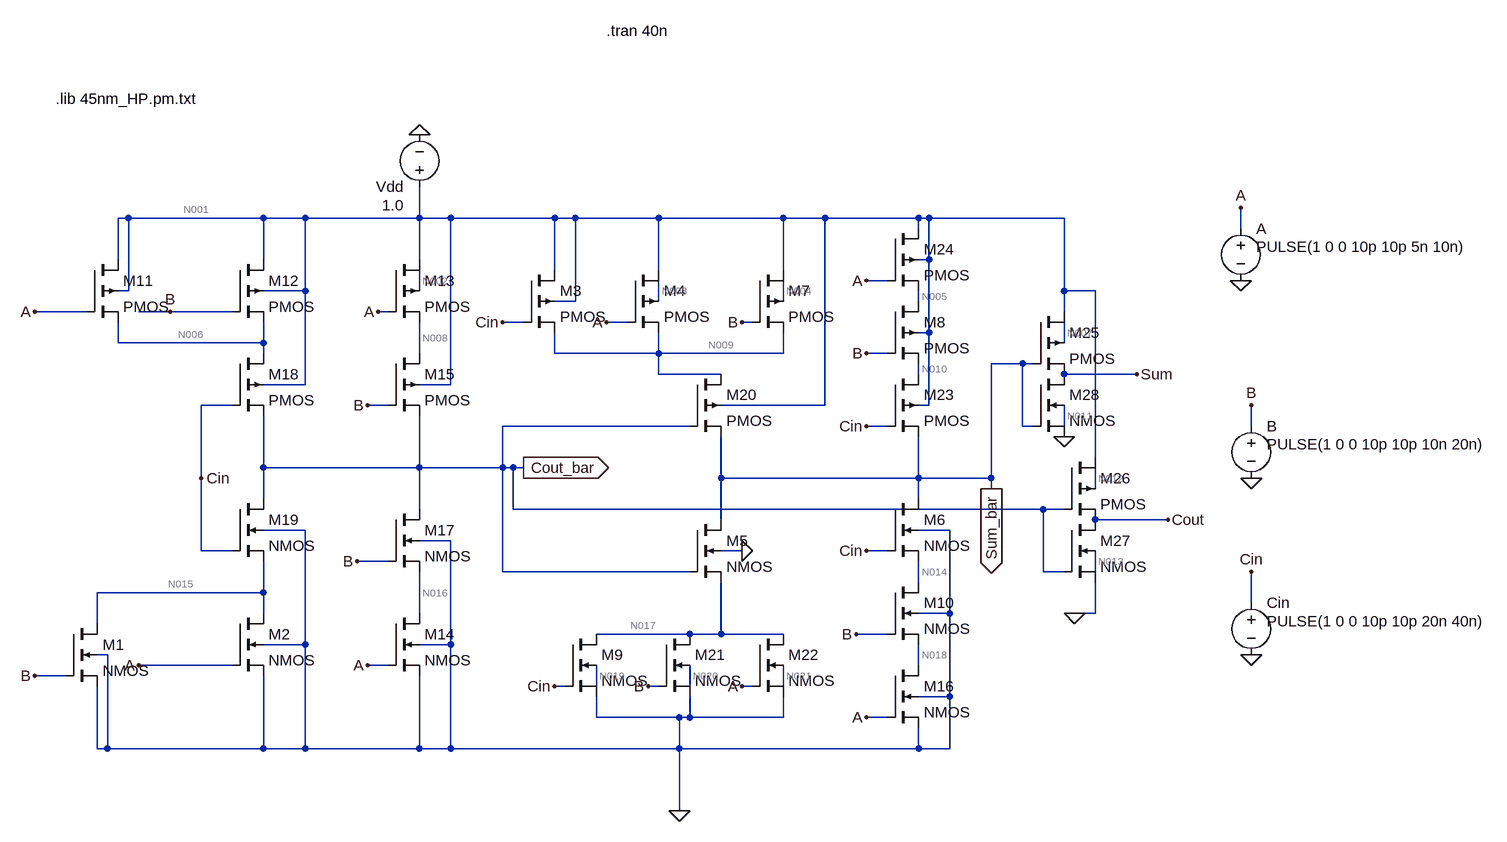
[diagram p0: schematic 28T_45nm.asc]
28T_45nm.asc, the LTspice schematic file:
Version 4
SHEET 1 1060 692
WIRE -1088 -240 -1104 -240
WIRE -880 -240 -1088 -240
WIRE -816 -240 -880 -240
WIRE -640 -240 -640 -288
WIRE -640 -240 -816 -240
WIRE -592 -240 -640 -240
WIRE -432 -240 -592 -240
WIRE -400 -240 -432 -240
WIRE -272 -240 -400 -240
WIRE -80 -240 -272 -240
WIRE -16 -240 -80 -240
WIRE 128 -240 -16 -240
WIRE 144 -240 128 -240
WIRE 352 -240 144 -240
WIRE 128 -224 128 -240
WIRE 624 -224 624 -256
WIRE -1104 -176 -1104 -240
WIRE -880 -176 -880 -240
WIRE -640 -176 -640 -240
WIRE 144 -176 144 -240
WIRE 144 -176 128 -176
WIRE -432 -160 -432 -240
WIRE -272 -160 -272 -240
WIRE -80 -160 -80 -240
WIRE 80 -144 48 -144
WIRE -1088 -128 -1088 -240
WIRE -1088 -128 -1104 -128
WIRE -816 -128 -816 -240
WIRE -816 -128 -880 -128
WIRE -640 -128 -640 -160
WIRE 352 -128 352 -240
WIRE 400 -128 352 -128
WIRE -400 -112 -400 -240
WIRE -400 -112 -432 -112
WIRE -272 -112 -272 -144
WIRE -80 -112 -80 -144
WIRE 128 -112 128 -128
WIRE -1152 -96 -1232 -96
WIRE -1024 -96 -1072 -96
WIRE -928 -96 -1024 -96
WIRE -688 -96 -704 -96
WIRE 352 -96 352 -128
WIRE -480 -80 -512 -80
WIRE -320 -80 -352 -80
WIRE -128 -80 -144 -80
WIRE 144 -64 144 -176
WIRE 144 -64 128 -64
WIRE -1104 -48 -1104 -80
WIRE -880 -48 -880 -80
WIRE -880 -48 -1104 -48
WIRE 352 -48 352 -80
WIRE -880 -32 -880 -48
WIRE -640 -32 -640 -80
WIRE -432 -32 -432 -64
WIRE -272 -32 -272 -64
WIRE -272 -32 -432 -32
WIRE -80 -32 -80 -64
WIRE -80 -32 -272 -32
WIRE 80 -32 48 -32
WIRE 288 -16 240 -16
WIRE 304 -16 288 -16
WIRE -272 0 -272 -32
WIRE -176 0 -272 0
WIRE 128 0 128 -16
WIRE 464 0 352 0
WIRE -816 16 -816 -128
WIRE -816 16 -880 16
WIRE -592 16 -592 -240
WIRE -592 16 -640 16
WIRE -928 48 -976 48
WIRE -688 48 -720 48
WIRE -16 48 -16 -240
WIRE -16 48 -176 48
WIRE 144 48 144 -64
WIRE 144 48 128 48
WIRE -224 80 -512 80
WIRE 80 80 48 80
WIRE 288 80 288 -16
WIRE 304 80 288 80
WIRE 352 80 352 48
WIRE 640 80 640 48
WIRE 400 128 400 -128
WIRE -880 144 -880 64
WIRE -640 144 -640 64
WIRE -640 144 -880 144
WIRE -512 144 -512 80
WIRE -512 144 -640 144
WIRE -496 144 -512 144
WIRE -480 144 -496 144
WIRE -976 160 -976 48
WIRE -176 160 -176 96
WIRE 128 160 128 96
WIRE 128 160 -176 160
WIRE 240 160 240 -16
WIRE 240 160 128 160
WIRE 240 176 240 160
WIRE 400 176 400 144
WIRE -880 192 -880 144
WIRE 128 192 128 160
WIRE -640 208 -640 144
WIRE -496 208 -496 144
WIRE 320 208 -496 208
WIRE 352 208 320 208
WIRE -176 224 -176 160
WIRE 512 224 400 224
WIRE -816 240 -880 240
WIRE 176 240 128 240
WIRE -592 256 -640 256
WIRE -976 272 -976 160
WIRE -928 272 -976 272
WIRE -144 272 -176 272
WIRE 80 272 48 272
WIRE -688 288 -736 288
WIRE -512 304 -512 144
WIRE -224 304 -512 304
WIRE 320 304 320 208
WIRE 352 304 320 304
WIRE 400 304 400 272
WIRE 128 320 128 288
WIRE -880 336 -880 288
WIRE -880 336 -1136 336
WIRE 640 352 640 304
WIRE -880 368 -880 336
WIRE -640 368 -640 304
WIRE 176 368 176 240
WIRE 176 368 128 368
WIRE 368 368 352 368
WIRE 400 368 400 320
WIRE 400 368 368 368
WIRE -1136 384 -1136 336
WIRE -224 400 -368 400
WIRE -176 400 -176 320
WIRE -176 400 -224 400
WIRE -80 400 -176 400
WIRE 80 400 32 400
WIRE -816 416 -816 240
WIRE -816 416 -880 416
WIRE -592 416 -592 256
WIRE -592 416 -640 416
WIRE -1120 432 -1136 432
WIRE -928 448 -1072 448
WIRE -688 448 -720 448
WIRE 128 448 128 416
WIRE -1184 464 -1232 464
WIRE -416 480 -432 480
WIRE -368 480 -368 448
WIRE -272 480 -288 480
WIRE -224 480 -224 448
WIRE -128 480 -144 480
WIRE -80 480 -80 448
WIRE 176 496 176 368
WIRE 176 496 128 496
WIRE -368 528 -368 496
WIRE -240 528 -368 528
WIRE -224 528 -224 496
WIRE -224 528 -240 528
WIRE -80 528 -80 496
WIRE -80 528 -224 528
WIRE 80 528 48 528
WIRE -1136 576 -1136 480
WIRE -1120 576 -1120 432
WIRE -1120 576 -1136 576
WIRE -880 576 -880 464
WIRE -880 576 -1120 576
WIRE -816 576 -816 416
WIRE -816 576 -880 576
WIRE -640 576 -640 464
WIRE -640 576 -816 576
WIRE -592 576 -592 416
WIRE -592 576 -640 576
WIRE -240 576 -240 528
WIRE -240 576 -592 576
WIRE 128 576 128 544
WIRE 128 576 -240 576
WIRE 176 576 176 496
WIRE 176 576 128 576
WIRE -240 672 -240 576
FLAG -240 672 0
FLAG -480 144 Cout_bar
IOPIN -480 144 Out
FLAG 240 176 Sum_bar
IOPIN 240 176 Out
FLAG 624 -144 0
FLAG 640 160 0
FLAG 640 432 0
FLAG 624 -256 A
FLAG 640 48 B
FLAG 640 304 Cin
FLAG -640 -368 0
FLAG -1024 -96 B
FLAG -144 -80 B
FLAG -1072 448 A
FLAG -352 -80 A
FLAG -976 160 Cin
FLAG 48 80 Cin
FLAG 48 272 Cin
FLAG -512 -80 Cin
FLAG -432 480 Cin
FLAG -288 480 B
FLAG -144 480 A
FLAG 48 -144 A
FLAG 48 -32 B
FLAG -1232 -96 A
FLAG -1232 464 B
FLAG -144 272 0
FLAG 32 400 B
FLAG 48 528 A
FLAG -720 48 B
FLAG -736 288 B
FLAG -704 -96 A
FLAG -720 448 A
FLAG 368 368 0
FLAG 352 96 0
FLAG 464 0 Sum
FLAG 512 224 Cout
SYMBOL voltage 624 -240 R0
WINDOW 3 24 44 Left 2
WINDOW 123 0 0 Left 0
WINDOW 39 0 0 Left 0
SYMATTR Value PULSE(1 0 0 10p 10p 5n 10n)
SYMATTR InstName A
SYMBOL voltage 640 64 R0
WINDOW 3 24 44 Left 2
WINDOW 123 0 0 Left 0
WINDOW 39 0 0 Left 0
SYMATTR Value PULSE(1 0 0 10p 10p 10n 20n)
SYMATTR InstName B
SYMBOL voltage 640 336 R0
WINDOW 3 24 44 Left 2
WINDOW 123 0 0 Left 0
WINDOW 39 0 0 Left 0
SYMATTR Value PULSE(1 0 0 10p 10p 20n 40n)
SYMATTR InstName Cin
SYMBOL voltage -640 -272 R180
WINDOW 3 24 -12 Left 2
WINDOW 123 0 0 Left 0
WINDOW 39 0 0 Left 0
SYMATTR Value 1.0
SYMATTR InstName Vdd
SYMBOL nmos4 80 192 R0
SYMATTR InstName M6
SYMATTR Value2 l=45n w=90n
SYMBOL pmos4 80 -224 R0
SYMATTR InstName M24
SYMATTR Value2 l=45n w=180n
SYMBOL pmos4 80 -112 R0
SYMATTR InstName M8
SYMATTR Value2 l=45n w=180n
SYMBOL pmos4 80 0 R0
SYMATTR InstName M23
SYMATTR Value2 l=45n w=180n
SYMBOL nmos4 80 320 R0
SYMATTR InstName M10
SYMATTR Value2 l=45n w=90n
SYMBOL nmos4 80 448 R0
SYMATTR InstName M16
SYMATTR Value2 l=45n w=90n
SYMBOL nmos4 -416 400 R0
SYMATTR InstName M9
SYMATTR Value2 l=45n w=90n
SYMBOL nmos4 -272 400 R0
SYMATTR InstName M21
SYMATTR Value2 l=45n w=90n
SYMBOL nmos4 -128 400 R0
SYMATTR InstName M22
SYMATTR Value2 l=45n w=90n
SYMBOL nmos4 -224 224 R0
SYMATTR InstName M5
SYMATTR Value2 l=45n w=90n
SYMBOL pmos4 -480 -160 R0
SYMATTR InstName M3
SYMATTR Value2 l=45n w=180n
SYMBOL pmos4 -320 -160 R0
SYMATTR InstName M4
SYMATTR Value2 l=45n w=180n
SYMBOL pmos4 -128 -160 R0
SYMATTR InstName M7
SYMATTR Value2 l=45n w=180n
SYMBOL pmos4 -224 0 R0
SYMATTR InstName M20
SYMATTR Value2 l=45n w=180n
SYMBOL pmos4 -1152 -176 R0
SYMATTR InstName M11
SYMATTR Value2 l=45n w=180n
SYMBOL pmos4 -928 -176 R0
SYMATTR InstName M12
SYMATTR Value2 l=45n w=180n
SYMBOL pmos4 -688 -176 R0
SYMATTR InstName M13
SYMATTR Value2 l=45n w=180n
SYMBOL pmos4 -688 -32 R0
SYMATTR InstName M15
SYMATTR Value2 l=45n w=180n
SYMBOL pmos4 -928 -32 R0
SYMATTR InstName M18
SYMATTR Value2 l=45n w=180n
SYMBOL nmos4 -1184 384 R0
SYMATTR InstName M1
SYMATTR Value2 l=45n w=90n
SYMBOL nmos4 -928 368 R0
SYMATTR InstName M2
SYMATTR Value2 l=45n w=90n
SYMBOL nmos4 -688 368 R0
SYMATTR InstName M14
SYMATTR Value2 l=45n w=90n
SYMBOL nmos4 -688 208 R0
SYMATTR InstName M17
SYMATTR Value2 l=45n w=90n
SYMBOL nmos4 -928 192 R0
SYMATTR InstName M19
SYMATTR Value2 l=45n w=90n
SYMBOL pmos4 304 -96 R0
SYMATTR InstName M25
SYMATTR Value2 l=45n w=180n
SYMBOL pmos4 352 128 R0
SYMATTR InstName M26
SYMATTR Value2 l=45n w=180n
SYMBOL nmos4 352 224 R0
SYMATTR InstName M27
SYMATTR Value2 l=45n w=90n
SYMBOL nmos4 304 0 R0
SYMATTR InstName M28
SYMATTR Value2 l=45n w=90n
TEXT -1200 -424 Left 2 !.lib 45nm_HP.pm.txt
TEXT -352 -528 Left 2 !.tran 40n

The netlist it stands for:
* 28T_45nm.asc
V§A A 0 PULSE(1 0 0 10p 10p 5n 10n)
V§B B 0 PULSE(1 0 0 10p 10p 10n 20n)
V§Cin Cin 0 PULSE(1 0 0 10p 10p 20n 40n)
Vdd N001 0 1.0
M6 Sum_bar Cin N014 0 NMOS l=45n w=90n
M24 N001 A N005 N001 PMOS l=45n w=180n
M8 N005 B N010 N001 PMOS l=45n w=180n
M23 N010 Cin Sum_bar N001 PMOS l=45n w=180n
M10 N014 B N018 0 NMOS l=45n w=90n
M16 N018 A 0 0 NMOS l=45n w=90n
M9 N017 Cin 0 N019 NMOS l=45n w=90n
M21 N017 B 0 N020 NMOS l=45n w=90n
M22 N017 A 0 N021 NMOS l=45n w=90n
M5 Sum_bar Cout_bar N017 0 NMOS l=45n w=90n
M3 N001 Cin N009 N001 PMOS l=45n w=180n
M4 N001 A N009 N003 PMOS l=45n w=180n
M7 N001 B N009 N004 PMOS l=45n w=180n
M20 N009 Cout_bar Sum_bar N001 PMOS l=45n w=180n
M11 N001 A N006 N001 PMOS l=45n w=180n
M12 N001 B N006 N001 PMOS l=45n w=180n
M13 N001 A N008 N002 PMOS l=45n w=180n
M15 N008 B Cout_bar N001 PMOS l=45n w=180n
M18 N006 Cin Cout_bar N001 PMOS l=45n w=180n
M1 N015 B 0 0 NMOS l=45n w=90n
M2 N015 A 0 0 NMOS l=45n w=90n
M14 N016 A 0 0 NMOS l=45n w=90n
M17 Cout_bar B N016 0 NMOS l=45n w=90n
M19 Cout_bar Cin N015 0 NMOS l=45n w=90n
M25 N001 Sum_bar Sum N007 PMOS l=45n w=180n
M26 N001 Cout_bar Cout N012 PMOS l=45n w=180n
M27 Cout Cout_bar 0 N013 NMOS l=45n w=90n
M28 Sum Sum_bar 0 N011 NMOS l=45n w=90n
.model NMOS NMOS
.model PMOS PMOS
.lib standard.mos
.lib 45nm_HP.pm.txt
.tran 40n
.backanno
.end

* Results of the author's LTspice run, read from the files saved beside the schematic
* Operating Point, zero values left out:
*   V(a) = 1 V
*   V(b) = 1 V
*   V(cin) = 1 V
*   V(n001) = 1 V
*   V(sum_bar) = 13.6 µV
*   V(n014) = 9.129 µV
*   V(n005) = 976.9 mV
*   V(n010) = 878.9 mV
*   V(n018) = 4.597 µV
*   V(n017) = 44.71 nV
*   V(n019) = 161.1 mV
*   V(n020) = 161.1 mV
*   V(n021) = 161.1 mV
*   V(cout_bar) = 1.39 µV
*   V(n009) = 277.9 mV
*   V(n003) = 873.1 mV
*   V(n004) = 873.1 mV
*   V(n006) = 909.4 mV
*   V(n008) = 911.6 mV
*   V(n002) = 887.9 mV
*   V(n015) = 495.7 nV
*   V(n016) = 727.4 nV
*   V(sum) = 1 V
*   V(n007) = 840.1 mV
*   V(cout) = 1 V
*   V(n012) = 840.1 mV
*   V(n013) = 260.1 mV
*   V(n011) = 260.1 mV
*   Id(M26) = 10.75 nA
*   Ig(M26) = -254.6 pA
*   Is(M26) = -10.49 nA
*   Id(M25) = 10.75 nA
*   Ig(M25) = -254.6 pA
*   Is(M25) = -10.49 nA
*   Id(M18) = 20.15 pA
*   Ig(M18) = 125.2 pA
*   Ib(M18) = 1.1 pA
*   Is(M18) = -146.5 pA
*   Id(M15) = 22.05 pA
*   Ig(M15) = 125.2 pA
*   Ib(M15) = 1.098 pA
*   Is(M15) = -148.3 pA
*   Id(M13) = 22.52 pA
*   Is(M13) = -22.05 pA
*   Id(M12) = 9.551 pA
*   Is(M12) = -10.08 pA
*   Id(M11) = 9.551 pA
*   Is(M11) = -10.08 pA
*   Id(M20) = 1.272 nA
*   Ib(M20) = 1.735 pA
*   Is(M20) = -1.273 nA
*   Id(M7) = 477.6 pA
*   Ig(M7) = 40.4 pA
*   Is(M7) = -517.1 pA
*   Id(M4) = 477.6 pA
*   Ig(M4) = 40.4 pA
*   Is(M4) = -517.1 pA
*   Id(M3) = 196.2 pA
*   Ig(M3) = 40.4 pA
*   Is(M3) = -237.4 pA
*   Id(M23) = 5.219 pA
*   Ig(M23) = 125.5 pA
*   Ib(M23) = 1.131 pA
*   Is(M23) = -131.8 pA
*   Id(M8) = 4.306 pA
*   Is(M8) = -5.219 pA
*   Id(M24) = 4.211 pA
*   Is(M24) = -4.306 pA
*   Id(M28) = 10.49 nA
*   Ig(M28) = -12.8 pA
*   Is(M28) = -10.48 nA
*   Id(M27) = 10.49 nA
*   Ig(M27) = -12.8 pA
*   Is(M27) = -10.48 nA
*   Id(M19) = 325 pA
*   Ig(M19) = 30.97 pA
*   Ib(M19) = -6.651 pA
*   Is(M19) = -349.4 pA
*   Id(M17) = 237.7 pA
*   Ig(M17) = 30.97 pA
*   Ib(M17) = -6.651 pA
*   Is(M17) = -262 pA
*   Id(M14) = 262 pA
*   Ig(M14) = 30.97 pA
*   Ib(M14) = -6.651 pA
*   Is(M14) = -286.3 pA
*   Id(M2) = 174.7 pA
*   Ig(M2) = 30.97 pA
*   Ib(M2) = -6.651 pA
*   Is(M2) = -199 pA
*   Id(M1) = 174.7 pA
*   Ig(M1) = 30.97 pA
*   Ib(M1) = -6.651 pA
*   Is(M1) = -199 pA
*   Ig(M22) = 29.87 pA
*   Is(M22) = -29.71 pA
*   Ig(M21) = 29.87 pA
*   Is(M21) = -29.71 pA
*   Ig(M9) = 29.87 pA
*   Is(M9) = -29.71 pA
*   Id(M16) = 1.721 nA
*   Ig(M16) = 30.97 pA
*   Ib(M16) = -6.651 pA
*   Is(M16) = -1.745 nA
*   Id(M10) = 1.696 nA
*   Ig(M10) = 30.97 pA
*   Ib(M10) = -6.65 pA
*   Is(M10) = -1.721 nA
*   Id(M6) = 1.672 nA
*   Ig(M6) = 30.97 pA
*   Ib(M6) = -6.65 pA
*   Is(M6) = -1.696 nA
*   I(Vdd) = -22.7 nA
*   I(Cin) = -382.9 pA
*   I(B) = -289.6 pA
*   I(A) = -164.1 pA
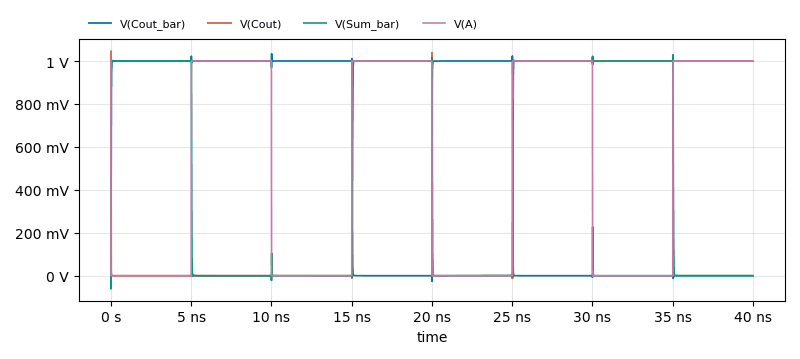
[diagram p1: Transient Analysis of 28T_45nm.asc, plotted from the saved traces]
* Transient Analysis, 1 run:
*   V(Cout_bar): min -58.44 mV, max 1.034 V, average 501.3 mV, rms 707.5 mV, last 10.56 µV
*   V(Cout): min -12.57 mV, max 1.046 V, average 498.7 mV, rms 705.9 mV, last 1 V
*   V(Sum_bar): min -61.09 mV, max 1.029 V, average 499.6 mV, rms 705.9 mV, last 49.93 µV
*   V(A): min 0 V, max 1 V, average 499 mV, rms 706.2 mV, last 1 V